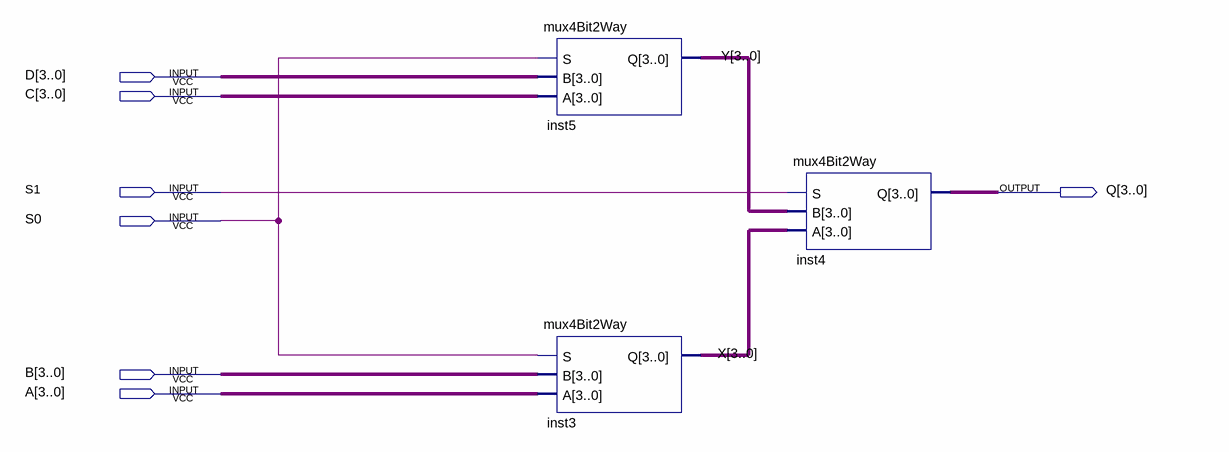
[diagram p0: schematic sheet]
// Quartus schematic mux4Bit4Way.bdf as structural Verilog: 3 symbols, 7 pins
module mux4Bit4Way (
  input  [3:0] D,
  input  [3:0] C,
  input  S1,
  input  S0,
  input  [3:0] B,
  input  [3:0] A,
  output [3:0] Q
);

  wire [3:0] X, Y;

  mux4Bit2Way inst5 (.S(S0), .B(D), .A(C), .Q(Y));
  mux4Bit2Way inst3 (.S(S0), .B(B), .A(A), .Q(X));
  mux4Bit2Way inst4 (.S(S1), .B(Y), .A(X), .Q(Q));
endmodule
